# EAGLE design L3D_Necklace_Rev1 (EAGLE 7.2.0)
L3D_NecklaceV0
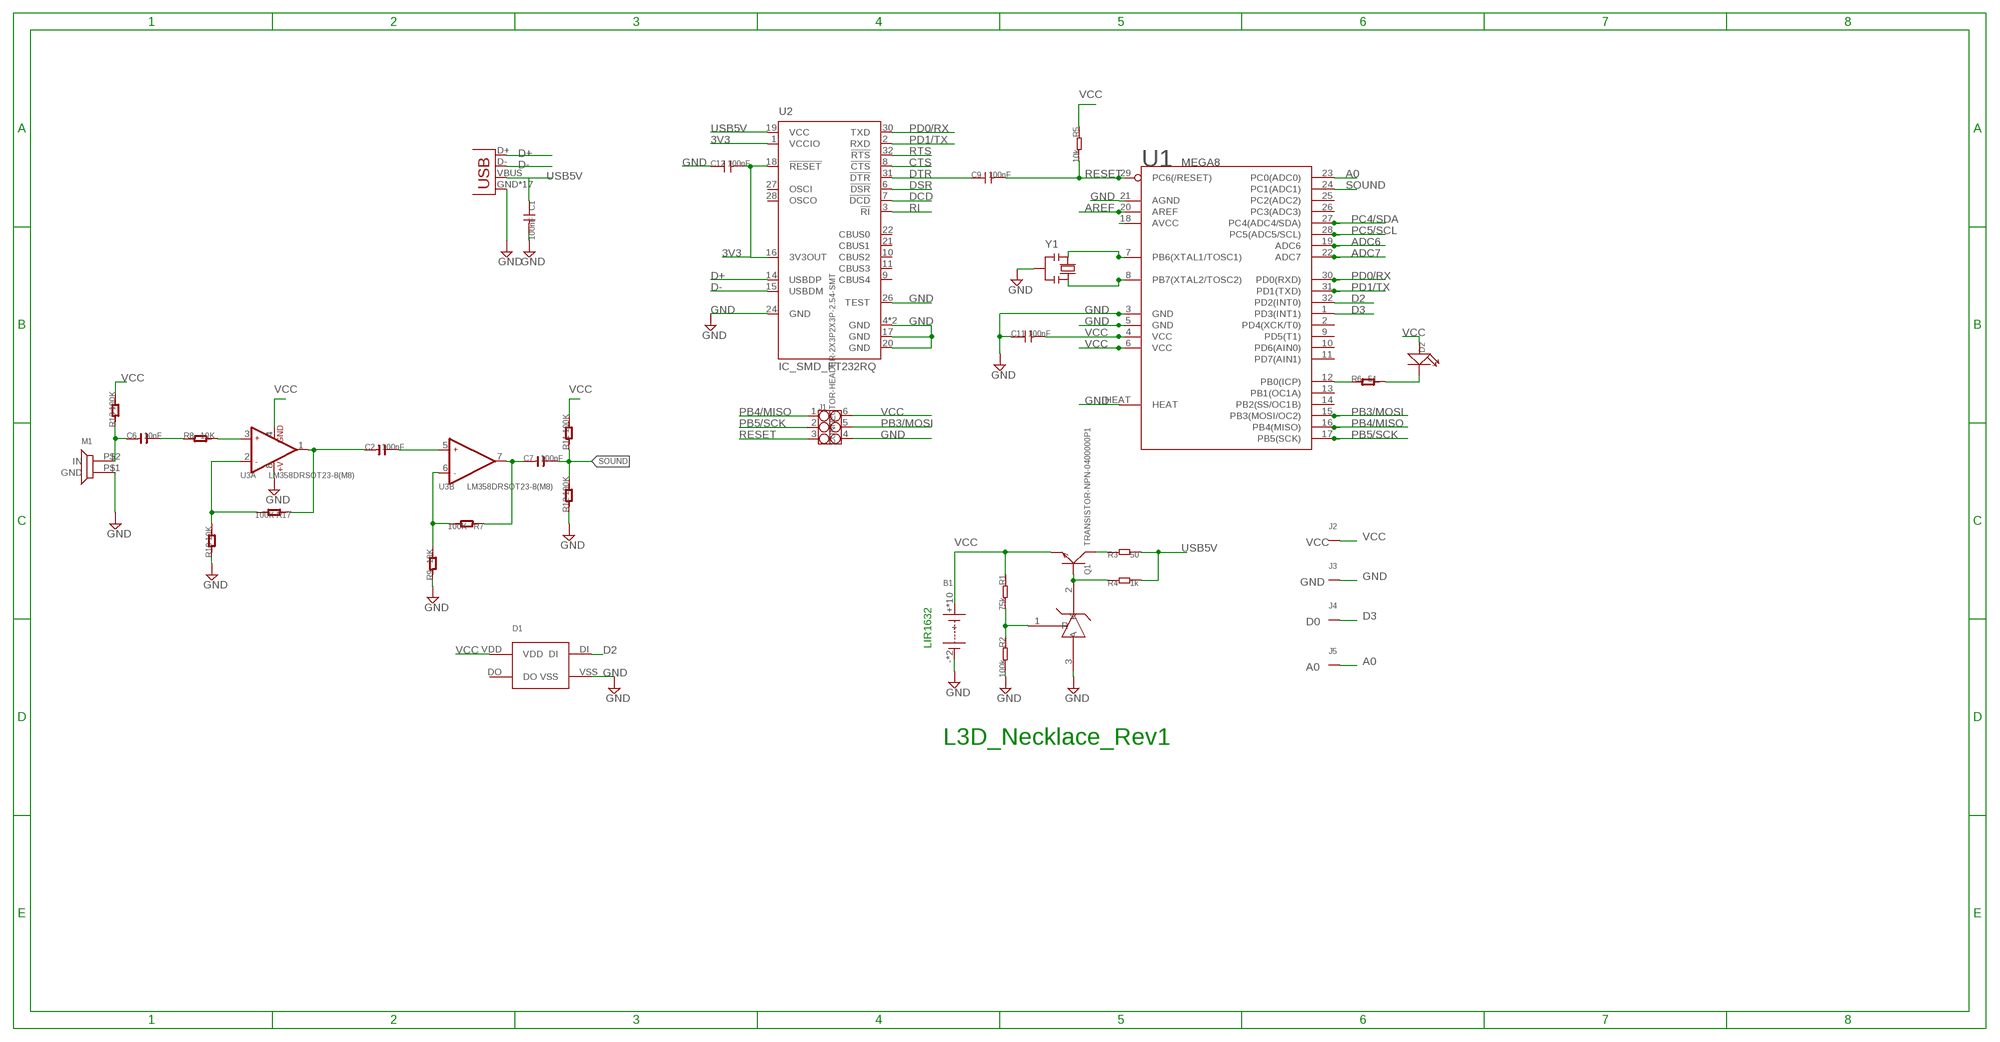
[diagram p0: schematic, sheet 1]

## Parts
B1  BUTTONCELLLIR1632  [BUTTONCELL_LIR1632]
C1  100nF  C-0603  [0603]
C2  100nF  C-0603  [C0603]
C6  10nF  C-0603  [C0603]
C7  100nF  C-0603  [C0603]
C9  100nF  C-0603  [0603]
C11  100nF  C-0603  [0603]
C12  100nF  C-0603  [0603]
D1  WS2812BWS2812B_STANDARD  [WS2812B_STANDARD]
D2  LEDLED1206  [LED1206]
J1  CONNECTOR-HEADER-2X3P2X3P-2.54-SMT  [2X3P-2.54-SMT]
J2  VCC  1R5MM-HOLE  [1R5MM-HOLE]
J3  GND  1R5MM-HOLE  [1R5MM-HOLE]
J4  D0  1R5MM-HOLE  [1R5MM-HOLE]
J5  A0  1R5MM-HOLE  [1R5MM-HOLE]
JP1  USBUSB-MICROB-SLOT-HOLE  [USB-MICROB-SLOT-HOLE]
M1  MICROPHONEMICROPHONE_1*3MM  [MICROPHONE_1*3MM]
Q1  TRANSISTOR-NPN-0400000P1  [SOT23]
R1  75k  R-0603  [0603]
R2  100k  R-0603  [0603]
R3  50  R-0603  [0603]
R4  1k  R-0603  [0603]
R5  10k  R-0603  [0603]
R6  51  R-0603  [R0603]
R7  100K  R-0603  [R0603]
R8  10K  R-0603  [R0603]
R9  10K  R-0603  [R0603]
R10  10K  R-0603  [R0603]
R11  100K  R-0603  [R0603]
R12  100K  R-0603  [R0603]
R13  100K  R-0603  [R0603]
R17  100K  R-0603  [R0603]
U1  MEGA8  [MLF32X]
U2  IC_SMD_FT232RQ  [IC_SMD_QFN32]
U3  LM358DRSOT23-8(M8)  [SOT-23-8(M8)]
Y1  SMARTPRJ_RESONATORMU  [SMARTPRJ_RESONATOR]
Z1  TL431  TL431SOT23  [SOT23]

## Nets
3V3: C12.2 U2.1(VCCIO) U2.16(3V3OUT) U2.18(!RESET)
A0: J5.P$1 U1.23(PC0(ADC0))
ADC6: U1.19(ADC6)
ADC7: U1.22(ADC7)
AREF: U1.20(AREF)
CTS: U2.8(!CTS)
D2: D1.DI U1.32(PD2(INT0))
D3: J4.P$1 U1.1(PD3(INT1))
D+: JP1.D+ U2.14(USBDP)
D-: JP1.D- U2.15(USBDM)
DCD: U2.7(!DCD)
DSR: U2.6(!DSR)
DTR: C9.1 U2.31(!DTR)
GND: B1.- B1.-'(-) C1.2 C11.1 C12.1 D1.VSS J1.4 J3.P$1 JP1.GND JP1.MT1(GND) JP1.MT2(GND) JP1.MT3(GND) JP1.MT4(GND) JP1.MT5(GND) JP1.MT6(GND) JP1.MT7(GND) JP1.MT8(GND) JP1.MT9(GND) JP1.MT10(GND) JP1.MT11(GND) JP1.MT12(GND) JP1.P$1(GND) JP1.P$2(GND) JP1.P$3(GND) JP1.P$4(GND) M1.P$1(GND) R2.2 R9.1 R10.1 R12.1 U1.3(GND) U1.5(GND) U1.21(AGND) U1.HEAT U2.4(GND) U2.17(GND) U2.20(GND) U2.24(GND) U2.26(TEST) U2.EXP(GND) U3.8(A:+V) Y1.2 Z1.3(A)
N$1: R1.2 R2.1 Z1.1(R)
N$2: Q1.1(B) R4.1 Z1.2(K)
N$3: R8.2 U3.3(A:+IN1)
N$4: Q1.3(C) R3.1
N$5: C2.1 R17.1 U3.1(A:OUT1)
N$6: R6.1 U1.12(PB0(ICP))
N$7: D2.- R6.2
N$8: R10.2 R17.2 U3.2(A:-IN1)
N$9: C7.1 R7.1 U3.7(B:OUT2)
N$10: C2.2 U3.5(B:+IN2)
N$11: R7.2 R9.2 U3.6(B:-IN2)
N$70: C6.2 R8.1
N$72: C6.1 M1.P$2(IN) R13.1
PB3/MOSI: J1.5 U1.15(PB3(MOSI/OC2))
PB4/MISO: J1.1 U1.16(PB4(MISO))
PB5/SCK: J1.2 U1.17(PB5(SCK))
PC4/SDA: U1.27(PC4(ADC4/SDA))
PC5/SCL: U1.28(PC5(ADC5/SCL))
PD0/RX: U1.30(PD0(RXD)) U2.30(TXD)
PD1/TX: U1.31(PD1(TXD)) U2.2(RXD)
RESET: C9.2 J1.3 R5.2 U1.29(PC6(/RESET))
RI: U2.3(!RI)
RTS: U2.32(!RTS)
SOUND: C7.2 R11.1 R12.2 U1.24(PC1(ADC1))
USB5V: C1.1 JP1.VBUS R3.2 R4.2 U2.19(VCC)
VCC: B1.+ B1.+1'(+) B1.P$3(+) B1.P$4(+) B1.P$5(+) B1.P$6(+) B1.P$7(+) B1.P$8(+) B1.P$9(+) B1.P$10(+) C11.2 D1.VDD D2.+ J1.6 J2.P$1 Q1.2(E) R1.1 R5.1 R11.2 R13.2 U1.4(VCC) U1.6(VCC) U1.18(AVCC) U3.4(A:GND)
XTAL1: U1.7(PB6(XTAL1/TOSC1)) Y1.1
XTAL2: U1.8(PB7(XTAL2/TOSC2)) Y1.3
Unconnected: D1.DO U1.2(PD4(XCK/T0)) U1.9(PD5(T1)) U1.10(PD6(AIN0)) U1.11(PD7(AIN1)) U1.13(PB1(OC1A)) U1.14(PB2(SS/OC1B)) U1.25(PC2(ADC2)) U1.26(PC3(ADC3)) U2.9(CBUS4) U2.10(CBUS2) U2.11(CBUS3) U2.21(CBUS1) U2.22(CBUS0) U2.27(OSCI) U2.28(OSCO)

## Notes on the sheet
- LIR1632
- L3D_Necklace_Rev1

## Library data of the parts
B1 = OPL Eagle Library:BUTTONCELL
C1 C9 C11 C12 = Discrete:C*: Ceramic Capacitors
C2 C6 C7 = OPL Eagle Library:C*
D1 = lumex:WS2812B
D2 = OPL Eagle Library:LED*: LED
J1 = OPL Eagle Library:CONNECTOR-HEADER-2X3P
J2-J5 = OPL Eagle Library:1R5MM-HOLE
JP1 = OPL Eagle Library:USB
M1 = OPL Eagle Library:MICROPHONE
Q1 = OPL Eagle Library:TRANSISTOR-NPN*: S9013：NPN Transistor
R1-R5 = Discrete:R*
R6-R13 R17 = OPL Eagle Library:R*
U1 = ICs_v54:MEGA8
U2 = Seeeduino v3.0:IC_SMD_FT232R: Source: http://www.ftdichip.com/Documents/DataSheets/DS_FT232R_v104.pdf
U3 = OPL Eagle Library:LM358DR: General purpose LOW Voltage, Rail-to-Rail Output Amplifiers http://www.fairchildsemi.com/ds/LM/LMV358.pdf
Y1 = arduino_Uno_Rev3-02-TH:SMARTPRJ_RESONATOR
Z1 = OPL Eagle Library:TL431

## Net classes
1 power: width 0.203 mm, drill 0.305 mm, clearance 0.203 mm
2 gnd: width 0.203 mm, drill 0.305 mm, clearance 0.203 mm
3 usbvcc: width 0.203 mm, drill 0.305 mm, clearance 0.203 mm

## Board
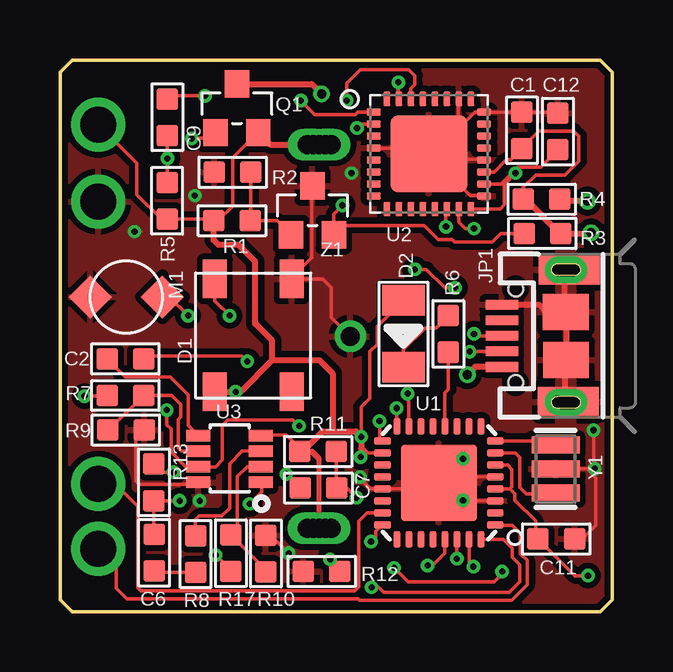
[diagram p1: board, top side]
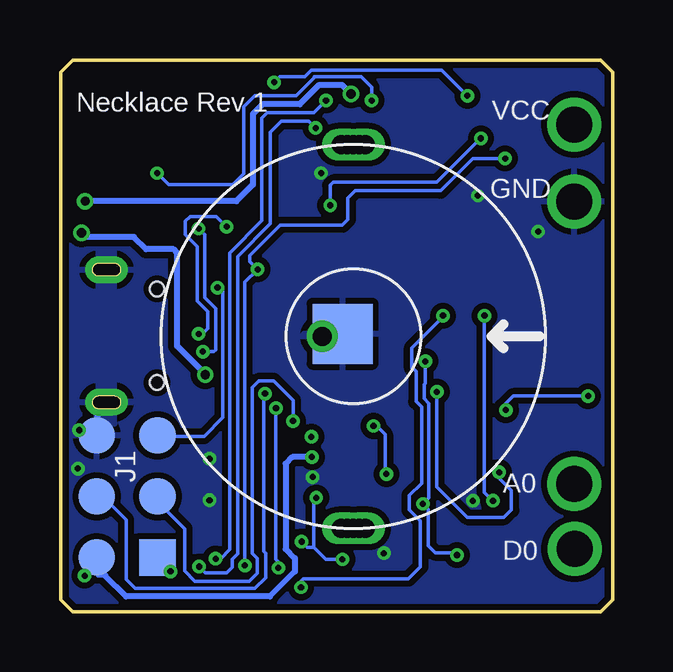
[diagram p2: board, bottom side, seen from below]

Size 23 x 23 mm. Coordinates in mm from the lower left corner, seen from the top.
Outline: 0.5,23 22.5,23 23,22.5 23,0.5 22.5,0 0.5,0 0,0.5 0,22.5 0.5,23
Copper layers (1*16): Top 0.035mm / dielectric 1.5mm / Bottom 0.035mm
Design rules "rule_manufacture_limit *": minimum track width 5mil, minimum drill 9mil, track to track 5mil, track to pad 6mil, pad to pad 6mil, via to via 7mil, smd to smd 0mil, copper to edge 10mil, drill to drill 10mil, minimum pad ring 10mil, minimum via ring 6mil, stop-mask expansion 2mil, vias tented up to drill 25mil, thermal gap 10mil
tRestrict: area 23.6,45.3 to 23.7,45.4

### Footprints (pad centres in the part's own frame; a part is rotated, then mirrored left to right if it is on the bottom)
BUTTONCELL_LIR1632 = drill 0.8 long: + -8,0; +1' 8,0 | smd 2.5 x 2.5: - -0.1,-0.45 | drill 0.8: -' 0,-1.3; P$3 -8,0.25; P$4 -8,0.5; P$5 -8,-0.25; P$6 -8,-0.5; P$7 8,0.25; P$8 8,0.5; P$9 8,-0.25; P$10 8,-0.5
0603 = smd 0.889 x 0.889: 1 -0.762,0; 2 0.762,0
C0603 = smd 0.889 x 0.889: 1 -0.762,0; 2 0.762,0
WS2812B_STANDARD = smd 1.6 x 1: DI 2.42,1.727; DO -2.286,-1.473; VDD -2.286,1.727; VSS 2.42,-1.473
LED1206 = smd 1.27 x 1.778: + -1.397,0; - 1.397,0
2X3P-2.54-SMT = smd 1.524 x 1.524: 1 -1.27,2.54; 2 -1.27,0; 3 -1.27,-2.54; 4 1.27,-2.54; 5 1.27,0; 6 1.27,2.54
1R5MM-HOLE = drill 1.5: P$1 0,0
USB-MICROB-SLOT-HOLE = smd 0.4 x 1.35: D+ 0,2.675; D- -0.65,2.675; GND 1.3,2.675; ID 0.65,2.675; VBUS -1.3,2.675 | drill 0.533 pad 1.1: MT1 -2.775,-0.33; MT2 2.75,-0.33; MT3 -2.775,-0.203; MT4 -2.775,-0.076; MT5 -2.775,0.051; MT6 -2.775,0.178; MT7 -2.762,0.33; MT8 2.75,-0.203; MT9 2.75,-0.076; MT10 2.75,0.051; MT11 2.75,0.178; MT12 2.75,0.33 | smd 1.5 x 1.9: P$1 -1,0; P$2 1,0.01 | smd 1.27 x 2.54: P$3 -2.769,-0.102; P$4 2.769,-0.127 | hole 0.6: -1.95,2.1; 1.95,2.1
MICROPHONE_1*3MM = smd 1.27 x 1.27 rotated 45: P$1 -1.5,0; P$2 1.5,0
SOT23 = smd 1.016 x 1.143: 1 -0.889,-1.016; 2 0.889,-1.016; 3 0,1.016
R0603 = smd 0.889 x 0.889: 1 -0.762,0; 2 0.762,0
MLF32X = smd 0.7 x 0.3: 1 -2.35,1.75; 2 -2.35,1.25; 3 -2.35,0.75; 4 -2.35,0.25; 5 -2.35,-0.25; 6 -2.35,-0.75; 7 -2.35,-1.25; 8 -2.35,-1.75; 17 2.35,-1.75; 18 2.35,-1.25; 19 2.35,-0.75; 20 2.35,-0.25; 21 2.35,0.25; 22 2.35,0.75; 23 2.35,1.25; 24 2.35,1.75 | smd 0.3 x 0.7: 9 -1.75,-2.35; 10 -1.25,-2.35; 11 -0.75,-2.35; 12 -0.25,-2.35; 13 0.25,-2.35; 14 0.75,-2.35; 15 1.25,-2.35; 16 1.75,-2.35; 25 1.75,2.35; 26 1.25,2.35; 27 0.75,2.35; 28 0.25,2.35; 29 -0.25,2.35; 30 -0.75,2.35; 31 -1.25,2.35; 32 -1.75,2.35 | smd 3.175 x 3.175: HEAT 0,0
IC_SMD_QFN32 = smd 0.6 x 0.3: 1 -2.3,1.75; 2 -2.3,1.25; 3 -2.3,0.75; 4 -2.3,0.25; 5 -2.3,-0.25; 6 -2.3,-0.75; 7 -2.3,-1.25; 8 -2.3,-1.75; 17 2.3,-1.75; 18 2.3,-1.25; 19 2.3,-0.75; 20 2.3,-0.25; 21 2.3,0.25; 22 2.3,0.75; 23 2.3,1.25; 24 2.3,1.75 | smd 0.3 x 0.6: 9 -1.75,-2.3; 10 -1.25,-2.3; 11 -0.75,-2.3; 12 -0.25,-2.3; 13 0.25,-2.3; 14 0.75,-2.3; 15 1.25,-2.3; 16 1.75,-2.3; 25 1.75,2.3; 26 1.25,2.3; 27 0.75,2.3; 28 0.25,2.3; 29 -0.25,2.3; 30 -0.75,2.3; 31 -1.25,2.3; 32 -1.75,2.3 | smd 3.2 x 3.2: EXP 0,0
SOT-23-8(M8) = smd 0.48 x 0.99: 1 -0.65,-1.3; 2 0,-1.3; 3 0.65,-1.3; 4 1.3,-1.3; 5 1.3,1.3; 6 0.65,1.3; 7 0,1.3; 8 -0.65,1.3
SMARTPRJ_RESONATOR = smd 0.7 x 2: 1 -1,0; 2 0,0; 3 1,0

### Placement (x,y rotation side)
B1  10.8,11.47 270 bottom
C1  19.25,20.07 90 top
C2  2.72,10.53 180 top
C6  3.92,2.46 270 top
C7  10.77,5.15 0 top
C9  4.47,20.61 270 top
C11  20.68,3.02 180 top
C12  20.74,20.01 270 top
D1  8.18,11.45 90 top
D2  14.31,11.57 270 top
J1  20.23,4.79 180 bottom
J2  1.6,20.31 0 top
J3  1.6,17.1 0 top
J4  1.59,2.61 0 top
J5  1.6,5.32 0 top
JP1  21.08,11.5 90 top
M1  2.77,13.12 0 top
Q1  7.37,20.98 0 top
R1  7.17,16.29 0 top
R2  7.19,18.32 180 top
R3  20.07,17.19 180 top
R4  20.1,15.77 0 top
R5  4.46,17.13 90 top
R6  16.18,11.57 90 top
R7  2.72,9.01 0 top
R8  5.65,2.4 90 top
R9  2.75,7.56 180 top
R10  8.57,2.42 270 top
R11  10.76,6.68 180 top
R12  10.9,1.68 0 top
R13  3.91,5.39 90 top
R17  7.12,2.44 90 top
U1  15.79,5.36 180 top
U2  15.37,19.08 0 top
U3  7.07,6.04 90 top
Y1  20.65,5.94 90 top
Z1  10.52,16.73 0 top

### Tracks (layer width: path | path; a pad name or v marks a point on that pad's centre or on a via)
3V3  (via drill 0.25)
  Top 0.152: 18.52,17.98 18.37,17.83 U2.18 18.52,17.83 v18.98,18.28 | 20.78,19.21 C12.2 20.02,18.54 19.08,18.54 18.52,17.98 | U2.16 18.34,16.78 18.52,16.96 18.52,17.98 | U2.1 12.41,20.83 12.3,20.72 10.62,20.72 v10.04,21.3 10.11,21.23 10.16,21.23
  Bottom 0.152: v10.04,21.3 10.04,21.86 10.47,22.3 12.43,22.3 12.43,22.27 13.19,21.51 14.91,21.51 15.37,21.05 15.37,18.26 15.83,17.8 18.49,17.8 v18.98,18.28
A0
  Top 0.152: J5.P$1 2.3,5.32 3.23,4.39 3.23,0.98 3.36,0.86 12.27,0.86 12.45,1.04 12.45,3.75 12.81,4.11 U1.23
D2  (via drill 0.25)
  Top 0.152: U1.32 18.47,3.01 18.85,2.63 18.85,2.25 19.16,1.95 19.16,1.24 18.72,0.81 13.49,0.81 13.29,1.01 v12.98,1.01 | D1.DI 6.46,12.95 v7.06,12.34
  Bottom 0.152: v7.06,12.34 7.02,12.34 8.36,10.99 8.36,10.15 8.34,10.15 8.18,10 8.18,8.76 7.95,8.53 7.95,5.35 8.46,4.84 8.46,4.24 8,3.78 8,1.87 8.51,1.37 12.88,1.37 13.06,1.19 13.06,1.09 v12.98,1.01
D3
  Top 0.152: U1.1 18.15,3.6 18.85,3.6 19.18,3.27 19.18,2.41 19.46,2.13 19.46,1.11 18.83,0.48 12.48,0.48 12.43,0.53 2.77,0.53 2.34,0.96 2.34,1.86 J4.P$1
D+  (via drill 0.25)
  Top 0.152: v16.08,16.05 16.08,16.74 U2.14 | v17.25,11.58 17.3,11.5 JP1.D+
  Bottom 0.152: v16.08,16.05 16.51,16.48 17.61,16.48 17.81,16.27 17.81,15.72 17.3,15.21 17.3,12.95 16.87,12.52 16.87,11.8 17.12,11.55 v17.25,11.58
D-  (via drill 0.25)
  Top 0.152: U2.15 16.62,16.25 16.89,15.97 v17.25,15.97 | v17.07,10.84 17.03,10.85 JP1.D-
  Bottom 0.152: v17.25,15.97 17,15.72 17,13.1 16.54,12.64 16.54,10.92 16.62,10.84 v17.07,10.84
DTR  (via drill 0.25)
  Top 0.152: U2.31 14.1,21.4 v14.1,22.07 | v6.05,21.51 4.61,21.51 C9.1
  Bottom 0.152: v6.05,21.51 7.12,22.57 12.55,22.57 12.83,22.3 13.87,22.3 v14.1,22.07
GND  (via drill 0.25)
  Top 0.152: C12.1 20.68,20.83 C1.2 U2.24 17.28,20.82 16.69,20.24 | B1.-' 11.31,12.27 11.31,13.51 10.94,13.87 D1.VSS 9.66,13.91 10.49,14.75 10.49,17.72 Z1.3 | 21.97,5.94 22.33,5.58 22.33,3.58 21.77,3.02 C11.1 | 21.97,5.94 Y1.2 | U1.5 17.35,5.61 17.23,5.48 | 17.23,5.48 17.23,4.59 | 17.23,4.59 17.25,4.61 U1.3 | 17.23,5.48 15.9,5.48 U1.HEAT 15.54,5.11 U1.21 12.94,5.11 12.7,5.35 12.7,5.4 v12.5,5.61 | 21.97,5.94 22.23,6.2 v22.23,7.56 | U2.20 17.63,18.87 16.39,18.87 | 16.39,18.87 16.16,18.87 15.95,19.08 U2.EXP | U2.4 13.95,19.32 14.19,19.08 U2.EXP | 16.69,20.24 15.53,19.08 U2.EXP | U2.26 16.59,21.35 16.59,20.24 16.69,20.24 | U2.17 17.67,17.34 17.1,17.34 16.41,18.03 16.41,18.84 16.39,18.87 | R9.1 3.15,7.21 3.15,5.46 3.31,5.3 5.68,5.3 U3.8 | v3.1,15.84 3.36,15.84 | 17.23,4.59 16.84,4.59 v16.79,4.64 | R10.1 8.78,3.18 v9.53,2.43
  Top 0.254: JP1.GND 19.97,12.79 20.26,12.5 JP1.P$2 | JP1.P$2 21.03,12.54 JP1.MT10 | JP1.P$2 21.08,12.49 JP1.P$1 21.03,10.45 JP1.MT5 JP1.MT6 JP1.MT4 | JP1.MT4 JP1.P$3 | JP1.MT4 JP1.MT3 | JP1.MT3 JP1.MT1 | JP1.MT3 21.27,8.74 JP1.MT7 | JP1.MT10 JP1.MT9 | JP1.MT10 21.05,14.27 JP1.P$4 21.23,14.25 JP1.MT8 | JP1.MT10 JP1.MT11 | JP1.MT11 JP1.MT2 | JP1.MT11 JP1.MT12
  Bottom 0.152: B1.- 12,11.57 B1.-' | J1.4 21.95,7.33 v22.23,7.56 | J3.P$1 1.85,17.1 | v12.5,5.61 12.43,5.61 12.35,5.68
  Bottom 0.254: JP1.MT1 21.45,8.69 J1.4
  other vias: 5.62,17.34 12.15,18.28 22.28,5.96 16.79,6.37 5.82,4.62
  pour Top (isolate 0.254): 0,22.5 0.5,23 22.5,23 23,22.5 23,0.5 22.5,0 0.5,0 0,0.5
  pour Bottom (isolate 0.254): 0,22.5 0.5,23 22.5,23 23,22.5 23,0.5 22.5,0 0.5,0 0,0.5
N$1
  Top 0.152: R2.1 7.95,16.32 R1.2 9.05,16.29 Z1.1
N$2  (via drill 0.25)
  Top 0.152: Q1.1 6.24,19.73 v5.49,19.73 | v11.76,16.94 11.41,16.58 Z1.2 11.79,16.1 15.17,16.1 15.75,15.51 16.34,15.51 16.44,15.41 18.01,15.41 18.37,15.77 R4.1
  Bottom 0.152: v5.49,19.73 7.32,17.9 11.64,17.9 11.76,17.77 v11.76,16.94
N$3
  Top 0.152: U3.3 7.59,6.69 7.06,6.17 7.06,4.31 6.73,3.98 5.79,3.98 5.64,3.83 R8.2
N$4  (via drill 0.38)
  Top 0.254: Q1.3 10.48,22 v10.9,21.58 | v21.98,17.11 20.91,17.11 R3.1
  Bottom 0.254: v21.98,17.11 15.68,17.11 14.99,17.8 14.99,20.75 14.58,21.15 13.03,21.15 12.22,21.96 11.28,21.96 v10.9,21.58
N$5  (via drill 0.25)
  Top 0.152: C2.1 3.61,10.66 7.57,10.66 v7.8,10.43 | 7.12,1.31 R17.1 7.12,1.71 v6.48,2.36 | U3.1 8.41,5.34 8.41,5 v7.9,4.49
  Bottom 0.152: v6.48,2.36 6.58,2.46 7.4,2.46 7.67,2.74 7.67,4.26 v7.9,4.49 7.65,4.74 7.65,8.68 7.85,8.88 7.85,9.47 7.8,9.52 v7.8,10.43
N$6
  Top 0.152: R6.1 16.18,9.26 16.03,9.11 16.03,7.72 U1.12
N$7
  Top 0.152: D2.- 14.31,10.92 15.22,11.83 15.68,11.83 R6.2
N$8
  Top 0.152: R10.2 8.57,1.75 R17.2 7.4,3.47 7.4,5.63 7.8,6.04 U3.2
N$9  (via drill 0.25)
  Top 0.152: R7.1 1.94,8.98 v1.02,8.98 | v4.45,8.4 4.45,7.79 4.63,7.61 4.63,6.65 5.24,6.04 U3.7 6.48,6.04 6.76,6.32 6.76,7.77 6.99,8 9.71,8 v9.96,7.74 | C7.1 v9.43,5.73
  Bottom 0.152: v1.02,8.98 4.14,8.98 4.45,8.68 v4.45,8.4 | 10.04,7.74 v9.96,7.74 9.83,7.74 9.48,7.38 9.48,5.79 v9.43,5.73
N$10
  Top 0.152: C2.2 2.72,9.77 4.6,9.77 5.34,9.04 5.34,7.77 U3.5
N$11
  Top 0.152: R9.2 2.04,7.56 R7.2 4.65,9.01 5.03,8.63 5.03,8.12 4.93,8.02 4.93,6.83 5.06,6.7 5.75,6.7 U3.6
N$70
  Top 0.152: 5.31,1.75 R8.1 3.99,1.63 C6.2
N$72  (via drill 0.25)
  Top 0.152: M1.P$2 4.56,13.12 v5.34,12.34 | v4.98,4.62 3.92,4.62 R13.1 3.91,3.23 C6.1
  Bottom 0.152: v5.34,12.34 5.34,4.97 v4.98,4.62
PB3/MOSI  (via drill 0.25)
  Top 0.152: U1.15 14.54,9.01 v14.48,9.09
  Bottom 0.152: J1.5 21.24,4.79 20.27,3.83 20.27,1.34 19.89,0.96 14.91,0.96 14.46,1.42 14.46,2.43 14.53,2.51 14.53,9.01 14.48,9.06 v14.48,9.09
PB4/MISO  (via drill 0.25)
  Top 0.152: v14.03,8.48 14.03,7.73 U1.16 | v18.42,1.67 18.47,1.62 18.09,1.24 14.51,1.24 v13.92,1.82
  Bottom 0.152: v14.03,8.48 14.03,2.18 13.92,2.08 v13.92,1.82 | v18.42,1.67 18.96,1.88 J1.1
PB5/SCK  (via drill 0.25)
  Top 0.152: U1.17 13.31,7.24 v13.31,7.94
  Bottom 0.152: v13.31,7.94 13.31,8.81 14.13,9.62 14.74,9.62 15.02,9.34 15.02,2.43 14.81,2.23 14.81,1.59 15.14,1.26 17.4,1.26 17.84,1.7 17.84,3.45 18.96,4.57 J1.2
PD0/RX  (via drill 0.25)
  Top 0.152: v16.54,2.2 U1.30 | v11.94,21.3 11.94,22.04 12.5,22.6 14.53,22.6 14.79,22.35 14.79,21.96 14.62,21.8 U2.30
  Bottom 0.152: v16.54,2.2 16.34,2.2 15.96,2.59 15.96,14.95 14.61,16.3 14.61,20.57 14.38,20.8 12.45,20.8 v11.94,21.3
PD1/TX  (via drill 0.25)
  Top 0.152: U1.31 17.05,2.03 17.07,2.03 v17.23,1.87 | U2.2 12.54,20.33 v12.37,20.16
  Bottom 0.152: v17.23,1.87 16.97,1.62 16.08,1.62 15.85,1.85 15.85,2.18 15.62,2.41 15.62,14.8 14.25,16.17 14.25,19.98 13.8,20.44 12.65,20.44 v12.37,20.16
RESET  (via drill 0.25)
  Top 0.152: C9.2 4.47,17.9 R5.2 | 4.74,19.85 C9.2 | U1.29 16.03,2.43 15.52,1.92 v15.32,1.92 15.32,1.72 | C9.2 v4.47,18.89 | v16.46,13.51 16.03,13.51 15.27,14.27 v14.79,14.27
  Bottom 0.152: J1.3 18.94,7.31 17.02,7.31 16.23,8.1 16.23,13.35 16.39,13.51 v16.46,13.51 | v15.32,1.92 15.32,13.73 v14.79,14.27 15.12,14.6 15.12,14.85 13.85,16.12 11.26,16.12 11.03,16.35 11.03,17.24 10.72,17.55 7.17,17.55 5.82,18.89 v4.47,18.89
SOUND  (via drill 0.25)
  Top 0.152: R11.1 11.52,5.17 C7.2 11.94,5.15 v12.35,4.74 | 11.86,1.62 R12.2 11.26,2.08 v11.26,2.18 | U1.24 13.16,3.34 13.16,3.12 v12.96,2.91
  Bottom 0.152: 12.45,2.69 12.45,4.72 12.37,4.72 v12.35,4.74 | 12.45,2.69 11.94,2.18 v11.26,2.18 | 12.45,2.69 12.73,2.69 v12.96,2.91
USB5V  (via drill 0.38)
  Top 0.152: U2.19 18.09,18.33 18.6,18.84 18.78,18.84 C1.1 19.25,19.34 19.94,20.03 21.42,20.03 21.62,19.83 21.62,18.79 21.04,18.21 19.82,18.21 19.31,17.7 R3.2
  Top 0.254: JP1.VBUS 17.3,10.2 v16.97,9.87 | v22.13,15.79 22.1,15.77 R4.2 20.83,15.77 19.41,17.19 R3.2
  Bottom 0.254: v22.13,15.79 21.95,15.62 19.94,15.62 19.44,15.11 18.29,15.11 18.14,14.95 18.14,11.07 16.97,9.9 v16.97,9.87
VCC  (via drill 0.25)
  Top 0.152: U1.4 18.73,5.11 | 18.73,5.11 18.95,4.9 18.95,4.64 19.82,3.78 19.82,2.84 C11.2 21.44,1.49 v22,1.49 | 12.73,6.62 13.43,6.62 U1.18 12.7,6.61 | R11.2 10.12,6.67 | R5.1 6.33,16.37 R1.1 6.58,16.29 7.19,16.91 7.19,18.92 8.24,19.97 Q1.2 | J2.P$1 3.21,18.7 3.21,17.39 4.23,16.37 | U1.6 18.65,6.12 18.83,5.94 18.83,5.21 18.73,5.11 | R11.2 10.49,6.67 | R11.2 10,6.79 9.43,7.36 8.39,7.36 U3.4 | D2.+ 13.21,11.88 13.21,11.14 12.91,10.84 12.91,8.88 12.55,8.53 v12.55,7.28 | B1.P$9 B1.+1' 10.77,3.5 10.55,3.5 B1.P$7 B1.P$8 | B1.P$9 10.72,3.47 | B1.P$10 B1.P$9 | B1.P$4 B1.P$3 B1.+ B1.P$5 B1.P$6 | D1.VDD v7.32,9.16 7.37,9.16 | 3.64,6.42 R13.2 4.25,5.81 v4.73,5.81
  Top 0.203: 10.77,6.39 10.77,3.5
  Top 0.254: 12.73,6.62 12.55,6.8 v12.55,7.28 12.32,7.51 11.41,7.51 | 10.12,6.67 10.95,7.51 11.41,7.51 | Q1.2 8.75,19.48 B1.P$4 | 4.23,16.37 R5.1 | 10.49,6.67 10.77,6.39 | 12.7,6.61 v12.53,6.45 | D1.VDD 7.52,9.16 8.84,10.48 | 8.84,10.48 10.8,10.48 11.36,9.93 11.36,7.56 11.41,7.51 | 8.84,10.48 8.84,11.3 8.13,12.01 8.13,14.6 7.45,15.29 6.61,15.29 6.41,15.49 R1.1
  Bottom 0.152: v22,1.49 21.5,1.99 J1.6 21.5,1.55 21.44,1.49 21.14,1.49 | v4.73,5.81 4.7,5.53 4.22,5.05 4.22,4.24 4.53,3.93 6.05,3.93 7.32,5.2 v7.32,9.16
  Bottom 0.203: 13.24,1.67 14.28,0.63
  Bottom 0.254: v12.53,6.45 13.34,6.45 13.62,6.17 13.62,2.61 13.24,2.23 13.24,1.67 | 14.28,0.63 20.27,0.63 21.14,1.49
XTAL1
  Top 0.152: U1.7 18.96,6.61 19.16,6.42 19.16,5.17 19.44,4.9 20.6,4.9 Y1.1
XTAL2
  Top 0.152: U1.8 20.48,7.11 Y1.3

### Text on the board
bPlace: Necklace Rev 1